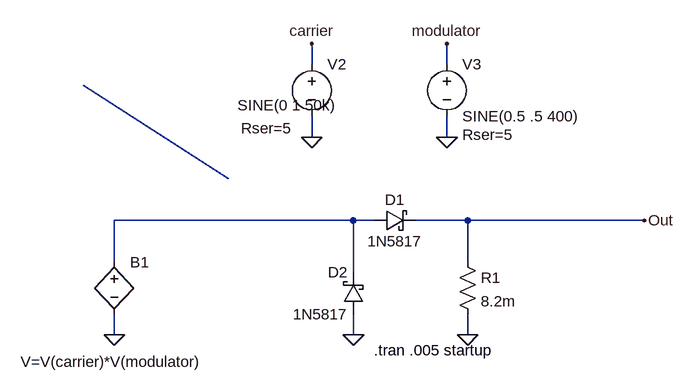
[diagram p0: schematic DiodeDetect1.asc]
DiodeDetect1.asc, the LTspice schematic file:
Version 4
SHEET 1 880 680
WIRE 128 -176 128 -208
WIRE 336 -176 336 -208
WIRE 128 -64 128 -96
WIRE 336 -64 336 -96
WIRE 192 64 -176 64
WIRE 224 64 192 64
WIRE 368 64 288 64
WIRE 640 64 368 64
WIRE -176 128 -176 64
WIRE 368 128 368 64
WIRE 192 144 192 64
WIRE -176 240 -176 208
WIRE 192 240 192 208
WIRE 368 240 368 208
WIRE -224 -144 0 0
FLAG -176 240 0
FLAG 192 240 0
FLAG 368 240 0
FLAG 640 64 Out
FLAG 128 -208 carrier
FLAG 128 -64 0
FLAG 336 -208 modulator
FLAG 336 -64 0
SYMBOL schottky 224 80 R270
WINDOW 0 32 32 VTop 2
WINDOW 3 0 32 VBottom 2
SYMATTR InstName D1
SYMATTR Value 1N5817
SYMATTR Description Diode
SYMATTR Type diode
SYMBOL res 352 112 R0
SYMATTR InstName R1
SYMATTR Value 8.2m
SYMBOL schottky 208 208 R180
WINDOW 0 24 64 Left 2
WINDOW 3 24 0 Left 2
SYMATTR InstName D2
SYMATTR Value 1N5817
SYMATTR Description Diode
SYMATTR Type diode
SYMBOL voltage 128 -192 R0
WINDOW 3 -114 79 Left 2
WINDOW 123 0 0 Left 0
WINDOW 39 -109 114 Left 2
SYMATTR Value SINE(0 1 50k)
SYMATTR SpiceLine Rser=5
SYMATTR InstName V2
SYMBOL voltage 336 -192 R0
WINDOW 123 0 0 Left 0
WINDOW 39 24 124 Left 2
SYMATTR SpiceLine Rser=5
SYMATTR InstName V3
SYMATTR Value SINE(0.5 .5 400)
SYMBOL bv -176 112 R0
WINDOW 3 -144 169 Left 2
SYMATTR Value V=V(carrier)*V(modulator)
SYMATTR InstName B1
TEXT 224 264 Left 2 !.tran .005 startup

The netlist it stands for:
* DiodeDetect1.asc
D1 N001 Out 1N5817
R1 Out 0 8.2m
D2 0 N001 1N5817
V2 carrier 0 SINE(0 1 50k) Rser=5
V3 modulator 0 SINE(0.5 .5 400) Rser=5
B1 N001 0 V=V(carrier)*V(modulator)
.model D D
.lib standard.dio
.tran .005 startup
.backanno
.end